# EAGLE design watch_game (EAGLE 8.5.0)
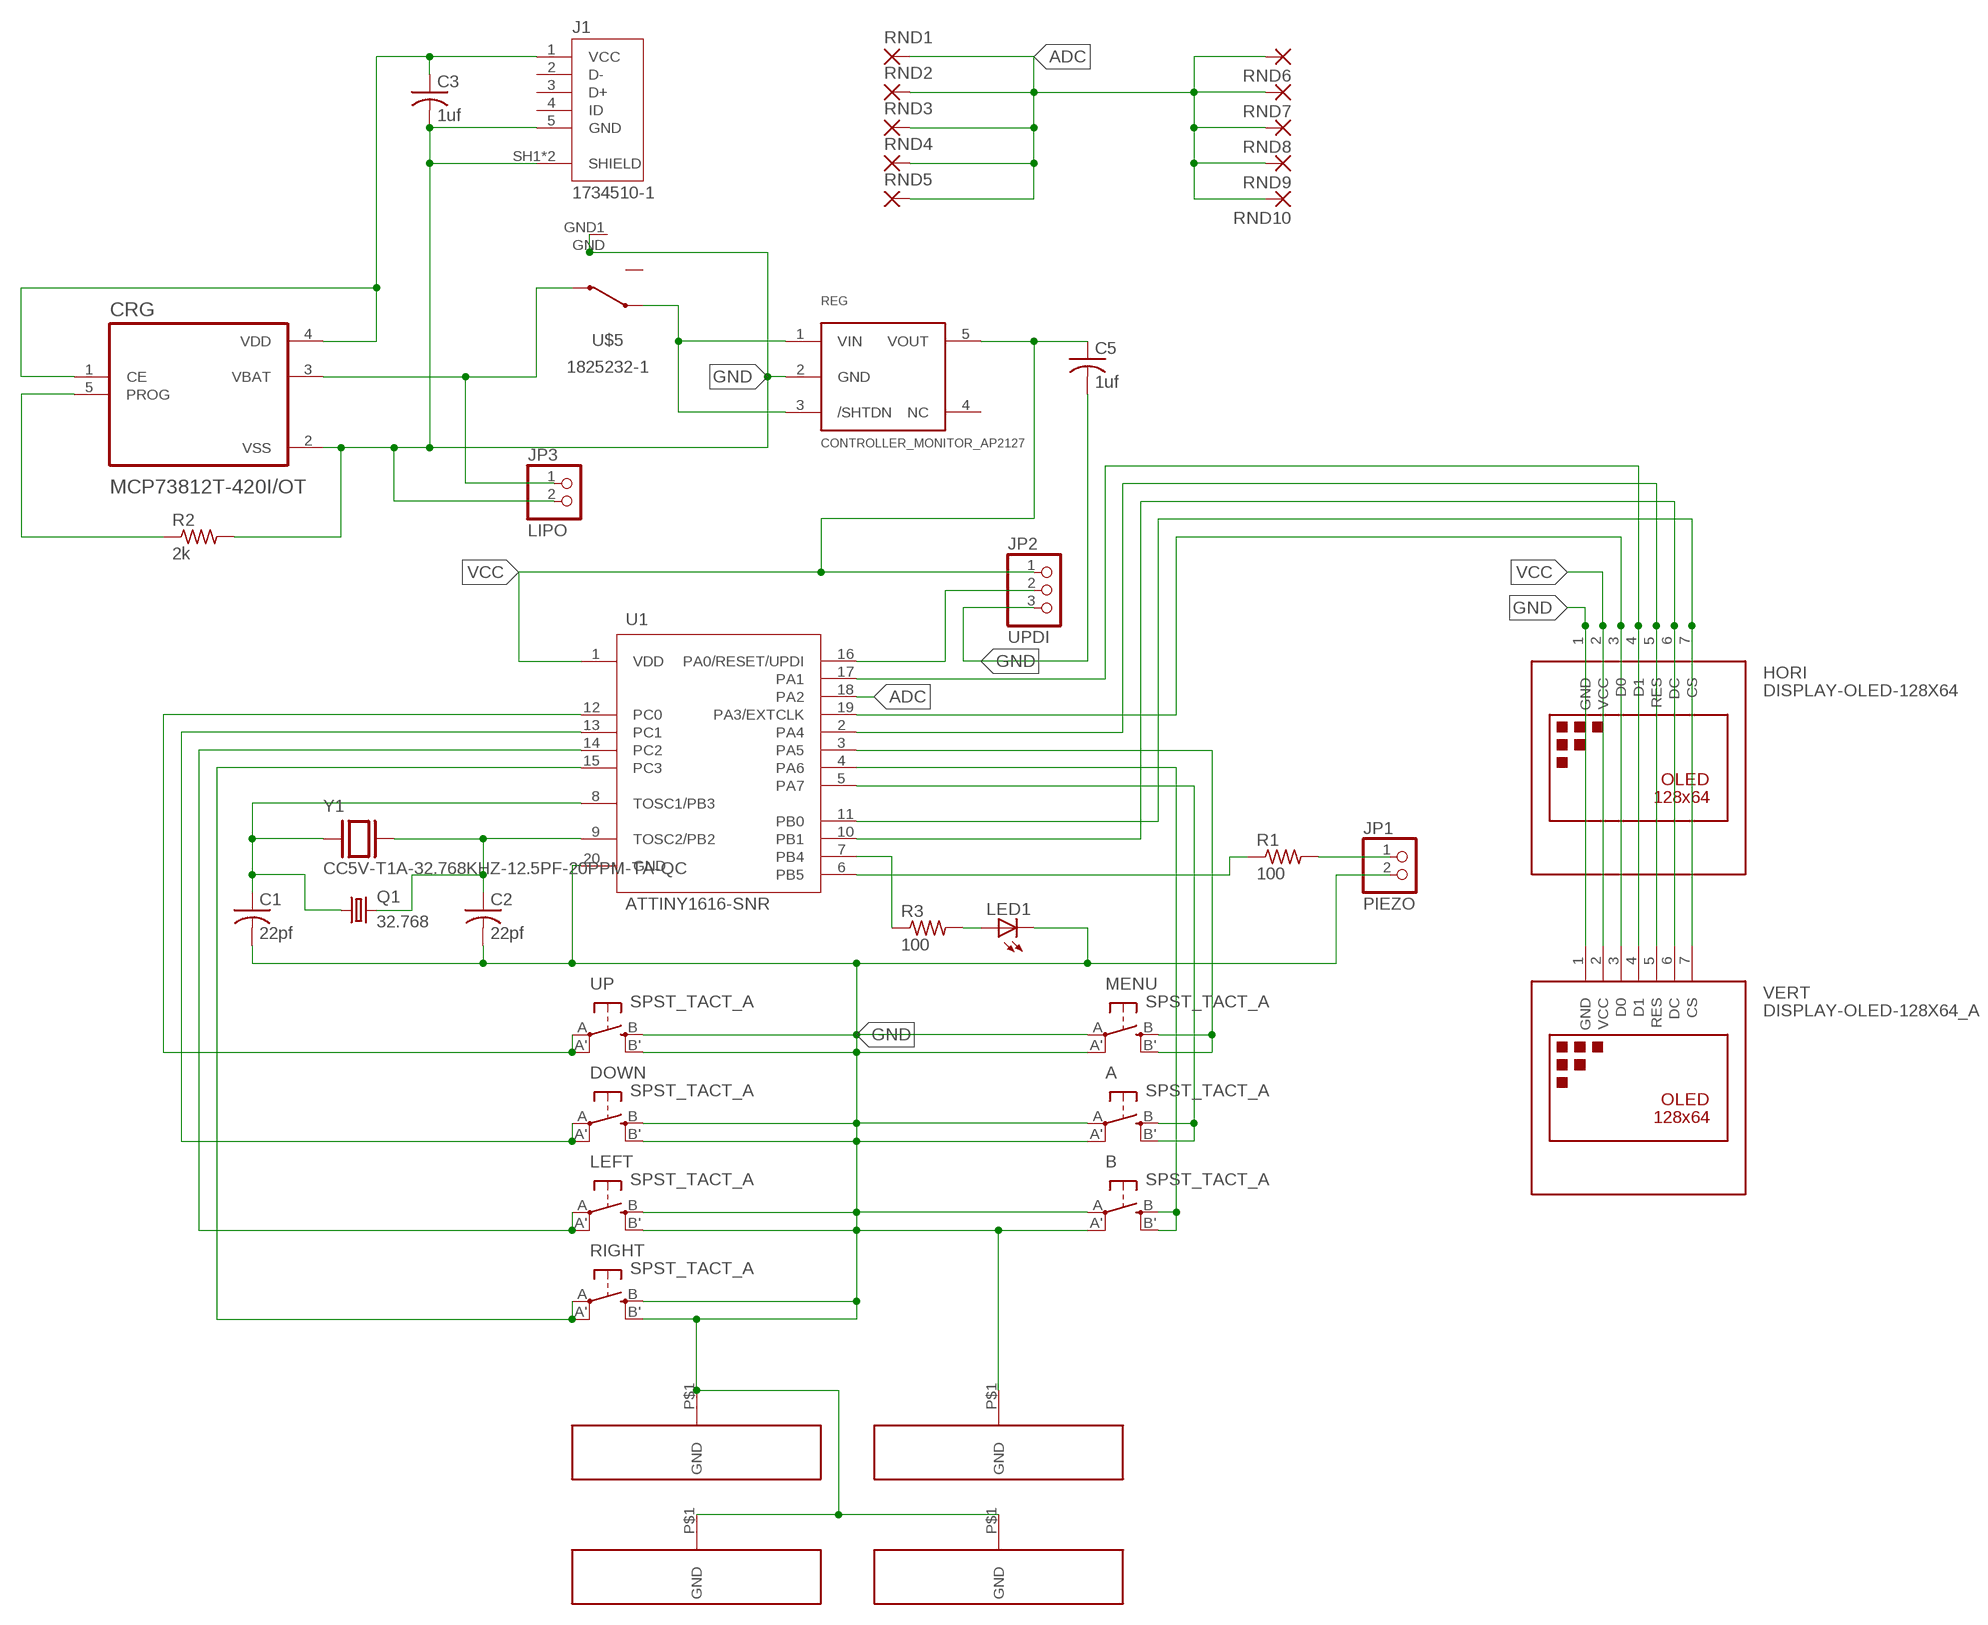
[diagram p0: schematic, sheet 1]

## Parts
A  SPST_TACT_A  [EVQ-Q2_A]
B  SPST_TACT_A  [EVQ-Q2_A]
C1  22pf  C-USC0805  [C0805]
C2  22pf  C-USC0805  [C0805]
C3  1uf  C-USC0805  [C0805]
C5  1uf  C-USC0805  [C0805]
CRG  MCP73812T-420I/OT  [SOT95P280X145-5N]
DOWN  SPST_TACT_A  [EVQ-Q2_A]
HORI  DISPLAY-OLED-128X64  [DISPLAY-OLED-128X64]
J1  1734510-1  [TE_1734510-1]
JP1  PIEZO  PINHD-1X2  [1X02]
JP2  UPDI  PINHD-1X3  [1X03]
JP3  LIPO  PINHD-1X2  [1X02]
LED1  LED5MM  [LED5MM]
LEFT  SPST_TACT_A  [EVQ-Q2_A]
MENU  SPST_TACT_A  [EVQ-Q2_A]
Q1  32.768  CRYSTALTC26H  [TC26H]
R1  100  R-US_M0805  [M0805]
R2  2k  R-US_M0805  [M0805]
R3  100  R-US_M0805  [M0805]
REG  CONTROLLER_MONITOR_AP2127  [CONTROLLER_MONITOR_SOT23-5]
RIGHT  SPST_TACT_A  [EVQ-Q2_A]
RND1  SMD5  [SMD2,54-5,08]
RND2  SMD5  [SMD2,54-5,08]
RND3  SMD5  [SMD2,54-5,08]
RND4  SMD5  [SMD2,54-5,08]
RND5  SMD5  [SMD2,54-5,08]
RND6  SMD5  [SMD2,54-5,08]
RND7  SMD5  [SMD2,54-5,08]
RND8  SMD5  [SMD2,54-5,08]
RND9  SMD5  [SMD2,54-5,08]
RND10  SMD5  [SMD2,54-5,08]
U1  ATTINY1616-SNR  [SOIC127P1032X265-20N]
U$5  1825232-1  [1825232-1]
U$6  GND_STRIP_600MIL  [GND_PADS_2]
U$7  GND_STRIP_600MIL  [GND_PADS_2]
U$8  GND_STRIP_600MIL  [GND_PADS_2]
U$9  GND_STRIP_600MIL  [GND_PADS_2]
UP  SPST_TACT_A  [EVQ-Q2_A]
VERT  DISPLAY-OLED-128X64_A  [DISPLAY-OLED-128X64_A]
Y1  CC5V-T1A-32.768KHZ-12.5PF-20PPM-TA-QC  [XTAL_CC5V-T1A-32.768KHZ-12.5PF-20PPM-TA-QC]

## Nets
ADC: RND1.1(P) RND2.1(P) RND3.1(P) RND4.1(P) RND5.1(P) RND6.1(P) RND7.1(P) RND8.1(P) RND9.1(P) RND10.1(P) U1.18(PA2)
GND: A.A'(P1) A.A(P) B.A'(P1) B.A(P) C1.2 C2.2 C3.2 C5.2 CRG.2(VSS) DOWN.B'(S1) DOWN.B(S) HORI.1(GND) J1.5(GND) J1.SH1(SHIELD) J1.SH2(SHIELD) JP1.2 JP2.3 JP3.2 LED1.K(C) LEFT.B'(S1) LEFT.B(S) MENU.A'(P1) MENU.A(P) R2.2 REG.2(GND) RIGHT.B'(S1) RIGHT.B(S) U1.20(GND) U$5.GND U$5.GND1 U$6.P$1(GND) U$7.P$1(GND) U$8.P$1(GND) U$9.P$1(GND) UP.B'(S1) UP.B(S) VERT.1(GND)
N$1: U1.12(PC0) UP.A'(P1) UP.A(P)
N$2: DOWN.A'(P1) DOWN.A(P) U1.13(PC1)
N$3: LEFT.A'(P1) LEFT.A(P) U1.14(PC2)
N$4: RIGHT.A'(P1) RIGHT.A(P) U1.15(PC3)
N$5: B.B'(S1) B.B(S) U1.4(PA6)
N$6: HORI.3(D0) U1.19(PA3/EXTCLK) VERT.3(D0)
N$7: R3.1 U1.7(PB4)
N$8: JP1.1 R1.2
N$9: C3.1 CRG.1(CE) CRG.4(VDD) J1.1(VCC)
N$10: REG.1(VIN) REG.3(/SHTDN) U$5.3
N$11: CRG.5(PROG) R2.1
N$12: CRG.3(VBAT) JP3.1 U$5.2
N$13: JP2.2 U1.16(PA0/RESET/UPDI)
N$14: HORI.4(D1) U1.17(PA1) VERT.4(D1)
N$16: HORI.5(RES) U1.2(PA4) VERT.5(RES)
N$17: MENU.B'(S1) MENU.B(S) U1.3(PA5)
N$18: LED1.A R3.2
N$19: A.B'(S1) A.B(S) U1.5(PA7)
N$20: HORI.7(CS) U1.11(PB0) VERT.7(CS)
N$21: HORI.6(DC) U1.10(PB1) VERT.6(DC)
N$23: R1.1 U1.6(PB5)
N$24: C1.1 Q1.1 U1.8(TOSC1/PB3) Y1.1
N$25: C2.1 Q1.2 U1.9(TOSC2/PB2) Y1.2
VCC: C5.1 HORI.2(VCC) JP2.1 REG.5(VOUT) U1.1(VDD) VERT.2(VCC)
Unconnected: J1.2(D-) J1.3(D+) J1.4(ID) REG.4(NC) U$5.1

## Library data of the parts
A B DOWN LEFT MENU RIGHT UP = adafruit:SPST_TACT_A: SMT 6mm switch, EVQQ2 series http://www.ladyada.net/library/eagle
C1 C2 = adafruit:C-US: CAPACITOR, American symbol
C3 C5 = rcl:C-US: CAPACITOR, American symbol; SPICEPREFIX: C
CRG = MCP73812T-420I_OT:MCP73812T-420I/OT: Check prices <https://pricing.snapeda.com/parts/MCP73812T-420I/OT/Microchip/view-part?ref=eda>; AVAILABILITY: In Stock; DESCRIPTION: Charger IC Lithium Ion/Polymer SOT-23-5; MF: Microchip; MP: MCP73812T-420I/OT; PACKAGE: SOT-23 Microchip; PRICE: None; PURCHASE-URL: https://pricing.snapeda.com/search/part/MCP73812T-420I/OT/?ref=eda
HORI = diy-modules:DISPLAY-OLED-128X64: 128x64 Dot Matrix OLED Module based on SSD1306 chip Variant with SPI interface More details available here: http://www.instructables.com/id/How-to-use-OLED-display-arduino-module/ SSD1306 datasheet: https://cdn-shop.adafruit.com/datasheets/SSD1306.pdf Click here to find device on ebay.com <http://www.ebay.com/sch/oled+display+128x64> Note: There are two variants: I2C and SPI. Search for the proper version.
J1 = USB 1734510-1:1734510-1: Conn Mini USB Type B RCP 5 POS 1.6mm Solder RA Thru-Hole 5 Terminal 1 Port Tray Check prices <https://pricing.snapeda.com/parts/1734510-1/TE%20Connectivity/view-part?ref=eda>; AVAILABILITY: In Stock; COMMENT: 1734510-1; DESCRIPTION: Conn Mini USB Type B RCP 5 POS 1.6mm Solder RA Thru-Hole 5 Terminal 1 Port Tray; MF: TE Connectivity; MP: 1734510-1; PACKAGE: None; PRICE: None; PURCHASE-URL: https://pricing.snapeda.com/search/part/1734510-1/?ref=eda
JP1 JP3 = pinhead:PINHD-1X2: PIN HEADER
JP2 = pinhead:PINHD-1X3: PIN HEADER
LED1 = led:LED: LED OSRAM: - CHIPLED LG R971, LG N971, LY N971, LG Q971, LY Q971, LO R971, LY R971 LH N974, LH R974 LS Q976, LO Q976, LY Q976 LO Q996 - Hyper CHIPLED LW Q18S LB Q993, LB Q99A, LB R99A - SideLED LS A670, LO A670, LY A670, LG A670, LP A670 LB A673, LV A673, LT A673, LW A673 LH A674 LY A675 LS A676, LA A676, LO A676, LY A676, LW A676 LS A679, LY A679, LG A679 - Hyper Micro SIDELED® LS Y876, LA Y876, LO Y876, LY Y876 LT Y87S - SmartLED LW L88C, LW L88S LB L89C, LB L89S, LG L890 LS L89K, LO L89K, LY L89K LS L896, LA L896, LO L896, LY L896 - TOPLED LS T670, LO T670, LY T670, LG T670, LP T670 LSG T670, LSP T670, LSY T670, LOP T670, LYG T670 LG T671, LOG T671, LSG T671 LB T673, LV T673, LT T673, LW T673 LH T674 LS T676, LA T676, LO T676, LY T676, LB T676, LH T676, LSB T676, LW T676 LB T67C, LV T67C, LT T67C, LS T67K, LO T67K, LY T67K, LW E67C LS E67B, LA E67B, LO E67B, LY E67B, LB E67C, LV E67C, LT E67C LW T67C LS T679, LY T679, LG T679 LS T770, LO T770, LY T770, LG T770, LP T770 LB T773, LV T773, LT T773, LW T773 LH T774 LS E675, LA E675, LY E675, LS T675 LS T776, LA T776, LO T776, LY T776, LB T776 LHGB T686 LT T68C, LB T68C - Hyper Mini TOPLED® LB M676 - Mini TOPLED Santana® LG M470 LS M47K, LO M47K, LY M47K Source: http://www.osram.convergy.de LUXEON: - LUMILED® LXK2-PW12-R00, LXK2-PW12-S00, LXK2-PW14-U00, LXK2-PW14-V00 LXK2-PM12-R00, LXK2-PM12-S00, LXK2-PM14-U00 LXK2-PE12-Q00, LXK2-PE12-R00, LXK2-PE12-S00, LXK2-PE14-T00, LXK2-PE14-U00 LXK2-PB12-K00, LXK2-PB12-L00, LXK2-PB12-M00, LXK2-PB14-N00, LXK2-PB14-P00, LXK2-PB14-Q00 LXK2-PR12-L00, LXK2-PR12-M00, LXK2-PR14-Q00, LXK2-PR14-R00 LXK2-PD12-Q00, LXK2-PD12-R00, LXK2-PD12-S00 LXK2-PH12-R00, LXK2-PH12-S00 LXK2-PL12-P00, LXK2-PL12-Q00, LXK2-PL12-R00 Source: www.luxeon.com KINGBRIGHT: KA-3528ASYC Source: www.kingbright.com
Q1 = adafruit:CRYSTAL: CRYSTAL; OC_FARNELL: unknown; OC_NEWARK: unknown
R1-R3 = resistor:R-US_: RESISTOR, American symbol
REG = Monitor_2018_j:CONTROLLER_MONITOR_AP2127
RND1-RND10 = wirepad:SMD5: SMD PAD
U1 = ATTINY1616-SNR:ATTINY1616-SNR: ATTiny1616 is a 20 pin Microcontroller with: - 5 selectable Voltage reference - 8 bit Dac - Multiplexable IOs(SPI, UART, I2C) And much more Datasheet <http://ww1.microchip.com/downloads/en/DeviceDoc/ATtiny1616-3216-DataSheet-DS40001997C.pdf> Check prices <https://pricing.snapeda.com/parts/ATTINY1616-SNR/Microchip/view-part?ref=eda>; AVAILABILITY: In Stock; DESCRIPTION: AVR tinyAVR™ 1, Functional Safety (FuSa) Microcontroller IC 8-Bit 20MHz 16KB (16K x 8) FLASH 20-SOIC; MF: Microchip; MP: ATTINY1616-SNR; PACKAGE: SOIC-20 Microchip; PRICE: None; PURCHASE-URL: https://pricing.snapeda.com/search/part/ATTINY1616-SNR/?ref=eda
U$5 = switch 1825232-1:1825232-1: Check prices <https://pricing.snapeda.com/parts/1825232-1/TE%20Connectivity/view-part?ref=eda>; AVAILABILITY: In Stock; COMMENT: 1825232-1; DESCRIPTION: Switch Slide ON None ON SPDT Side Slide 0.2A 30VDC 10000Cycle PC Pins Bracket Mount/Through Hole; EU_ROHS_COMPLIANCE: Compliant; MF: TE Connectivity; MP: 1825232-1; PACKAGE: None; PRICE: None; PURCHASE-URL: https://pricing.snapeda.com/search/part/1825232-1/?ref=eda
U$6-U$9 = Atari Vagabond:GND_STRIP_600MIL
VERT = diy-modules:DISPLAY-OLED-128X64_A: 128x64 Dot Matrix OLED Module based on SSD1306 chip Variant with SPI interface More details available here: http://www.instructables.com/id/How-to-use-OLED-display-arduino-module/ SSD1306 datasheet: https://cdn-shop.adafruit.com/datasheets/SSD1306.pdf Click here to find device on ebay.com <http://www.ebay.com/sch/oled+display+128x64> Note: There are two variants: I2C and SPI. Search for the proper version.
Y1 = CC5V-T1A-32.768KHZ-12.5PF-20PPM-TA-QC:CC5V-T1A-32.768KHZ-12.5PF-20PPM-TA-QC: Check prices <https://pricing.snapeda.com/parts/CC5V-T1A-32.768kHz-12.5pF-20PPM-TA-QC/Micro%20Crystal/view-part?ref=eda>; AVAILABILITY: In Stock; DESCRIPTION: LOW FREQUENCY CRYSTAL; MF: Micro Crystal; MP: CC5V-T1A-32.768kHz-12.5pF-20PPM-TA-QC; PACKAGE: SMT-2 Micro Crystal; PRICE: None; PURCHASE-URL: https://pricing.snapeda.com/search/part/CC5V-T1A-32.768kHz-12.5pF-20PPM-TA-QC/?ref=eda

## Board
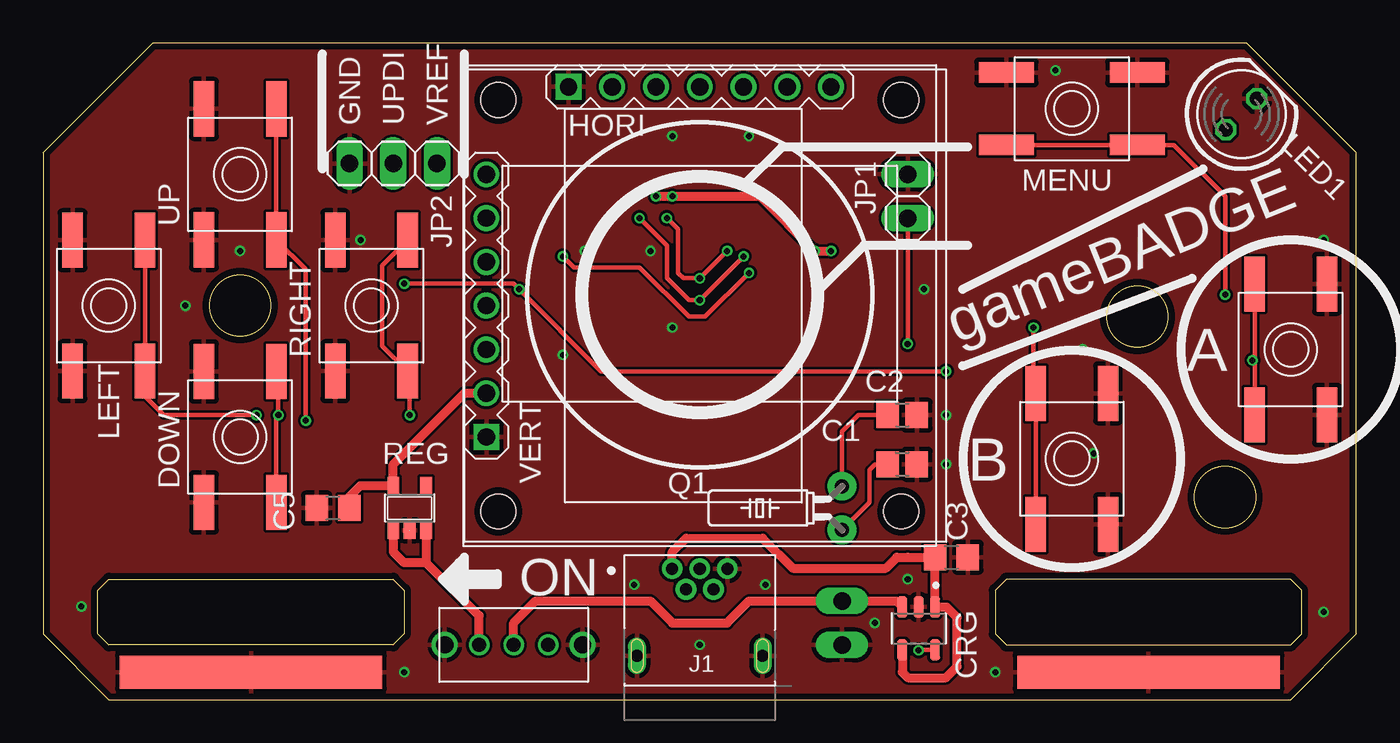
[diagram p1: board, top side]
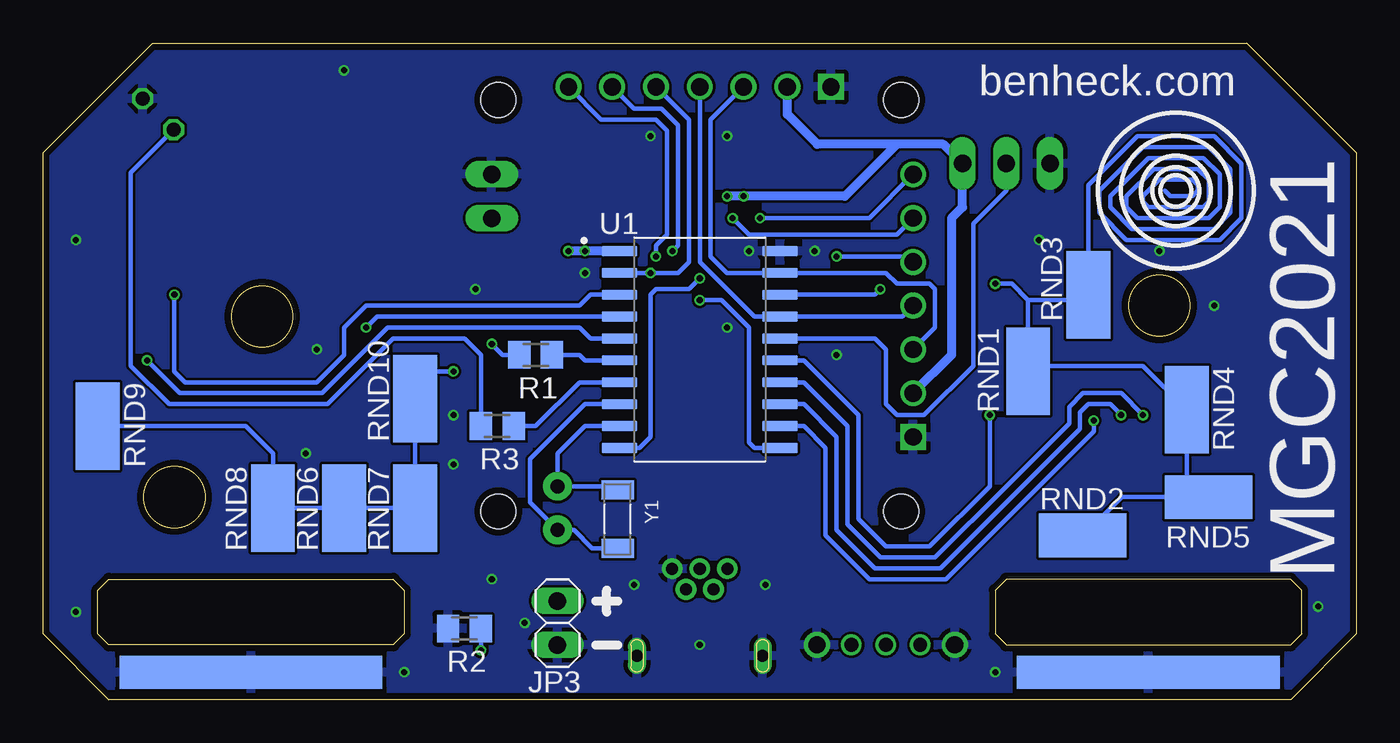
[diagram p2: board, bottom side, seen from below]

Size 76.2 x 38.1 mm. Coordinates in mm from the lower left corner, seen from the top.
Outline: 3.81,0 72.39,0 76.2,3.81 76.2,31.75 69.85,38.1 6.35,38.1 0,31.75 0,3.81 3.81,0
Outline: 3.17,3.81 3.17,6.35 3.81,6.99 20.32,6.99 20.95,6.35 20.95,3.81 20.32,3.17 3.81,3.17 3.17,3.81
Outline: 55.24,6.35 55.24,3.81 55.88,3.17 72.39,3.17 73.03,3.81 73.03,6.35 72.39,6.99 55.88,6.99 55.24,6.35
Outline: circle at 11.43,22.86 radius 1.78
Outline: circle at 68.58,11.75 radius 1.78
Outline: circle at 63.5,22.23 radius 1.78
Copper layers (1*16): Top 0.035559375mm / dielectric 1.6mm / Bottom 0.035559375mm
Design rules "oshpark-2layer": minimum track width 6mil, minimum drill 10mil, track to track 6mil, track to pad 6mil, pad to pad 6mil, via to via 6mil, smd to smd 6mil, copper to edge 15mil, drill to drill 6mil, minimum pad ring 5mil, minimum via ring 5mil, stop-mask expansion 2.5mil, vias tented up to drill 0mil, thermal gap 10mil

### Footprints (pad centres in the part's own frame; a part is rotated, then mirrored left to right if it is on the bottom)
EVQ-Q2_A = smd 3.2 x 1.2: A -3.8,-2.1; A' 3.8,-2.1; B -3.8,2.1; B' 3.8,2.1
C0805 = smd 1.3 x 1.5: 1 -0.85,0; 2 0.85,0
C0805' = smd 1.3 x 1.5: 1 -0.95,0; 2 0.95,0
SOT95P280X145-5N = smd 1.22 x 0.6: 1 -1.245,0.95; 2 -1.245,0; 3 -1.245,-0.95; 4 1.245,-0.95; 5 1.245,0.95
DISPLAY-OLED-128X64 = drill 1 square: 1 -7.62,12.7 | drill 1: 2 -5.08,12.7; 3 -2.54,12.7; 4 0,12.7; 5 2.54,12.7; 6 5.08,12.7; 7 7.62,12.7 | hole 2: -11.684,11.938; 11.684,11.938; 11.684,-11.938; -11.684,-11.938
TE_1734510-1 = drill 0.7 pad 1.2: 1 -1.6,5.05; 2 -0.8,3.85; 3 0,5.05; 4 0.8,3.85; 5 1.6,5.05 | drill 0.7 long: SH1 3.65,0; SH2 -3.65,0
1X02 = drill 1.016 long: 1 -1.27,0; 2 1.27,0
1X03 = drill 1.016 long: 1 -2.54,0; 2 0,0; 3 2.54,0
LED5MM = drill 0.813 octagon: A -1.27,0; K 1.27,0
TC26H = drill 0.813 pad 1.676: 1 -1.27,0; 2 1.27,0
M0805 = smd 1.3 x 1.6: 1 -0.95,0; 2 0.95,0
CONTROLLER_MONITOR_SOT23-5 = smd 0.69 x 0.99: 1 -0.95,-1.29; 2 0,-1.29; 3 0.95,-1.29; 4 0.95,1.3; 5 -0.95,1.3
SMD2,54-5,08 = smd 2.54 x 5.08: 1 0,0
SOIC127P1032X265-20N = smd 2.05 x 0.6: 1 -4.655,5.715; 2 -4.655,4.445; 3 -4.655,3.175; 4 -4.655,1.905; 5 -4.655,0.635; 6 -4.655,-0.635; 7 -4.655,-1.905; 8 -4.655,-3.175; 9 -4.655,-4.445; 10 -4.655,-5.715; 11 4.655,-5.715; 12 4.655,-4.445; 13 4.655,-3.175; 14 4.655,-1.905; 15 4.655,-0.635; 16 4.655,0.635; 17 4.655,1.905; 18 4.655,3.175; 19 4.655,4.445; 20 4.655,5.715
1825232-1 = drill 0.8: 1 -2,0; 2 0,0; 3 2,0 | drill 1: GND -4,0; GND1 4,0
GND_PADS_2 = smd 15.24 x 1.905: P$1 0,0
DISPLAY-OLED-128X64_A = drill 1 square: 1 -7.62,12.7 | drill 1: 2 -5.08,12.7; 3 -2.54,12.7; 4 0,12.7; 5 2.54,12.7; 6 5.08,12.7; 7 7.62,12.7
XTAL_CC5V-T1A-32.768KHZ-12.5PF-20PPM-TA-QC = smd 1.1 x 1.9: 1 -1.7,0; 2 1.7,0

### Placement (x,y rotation side)
A  72.39,20.32 90 top
B  59.69,13.97 90 top
C1  49.85,13.65 0 top
C2  49.85,16.51 0 top
C3  1uf  [C0805']  52.7,8.26 0 top
C5  1uf  [C0805']  16.83,11.11 180 top
CRG  50.8,4.13 270 top
DOWN  11.43,15.24 90 top
HORI  38.1,22.86 0 top
J1  38.1,2.54 0 top
JP1  50.16,29.21 90 top
JP2  20.32,31.11 180 top
JP3  46.35,4.45 270 bottom
LED1  69.53,33.97 45 top
LEFT  3.81,22.86 90 top
MENU  59.69,34.29 180 top
Q1  46.35,11.11 90 top
R1  47.62,20 180 bottom
R2  51.75,4.13 180 bottom
R3  49.85,15.88 180 bottom
REG  21.27,11.11 0 top
RIGHT  19.05,22.86 90 top
RND1  19.05,19.05 180 bottom
RND2  15.88,9.53 270 bottom
RND3  15.56,23.5 0 bottom
RND4  9.84,16.83 180 bottom
RND5  8.57,11.75 270 bottom
RND6  58.74,11.11 0 bottom
RND7  54.61,11.11 0 bottom
RND8  62.87,11.11 0 bottom
RND9  73.03,15.88 180 bottom
RND10  54.61,17.46 0 bottom
U1  38.1,20.32 0 bottom
U$5  27.3,3.17 180 top
U$6  12.06,1.59 0 top
U$7  64.14,1.59 0 top
U$8  12.06,1.59 180 bottom
U$9  64.14,1.59 0 bottom
UP  11.43,30.48 90 top
VERT  38.42,22.86 90 top
Y1  42.86,10.48 90 bottom

### Tracks (layer width: path | path; a pad name or v marks a point on that pad's centre or on a via)
ADC  (via drill 0.35)
  Top 0.254: v20.95,24.13 27.3,24.13 v27.62,23.81 32.38,19.05 v52.39,19.05
  Bottom 0.254: v27.62,23.81 27.94,23.5 U1.18 | v20.95,24.13 20,24.13 19.05,23.18 | RND1.1 19.05,19.37 | 19.05,19.37 19.05,23.18 | 19.05,23.18 15.88,23.18 RND3.1 15.56,29.84 12.7,32.7 8.26,32.7 6.67,31.11 6.67,27.94 7.94,26.67 13.34,26.67 14.92,28.26 14.92,29.53 12.38,32.07 8.57,32.07 7.3,30.8 7.3,28.26 8.26,27.3 13.02,27.3 14.29,28.57 14.29,29.21 12.06,31.43 8.89,31.43 7.94,30.48 7.94,28.57 8.57,27.94 12.7,27.94 13.34,28.57 13.34,29.21 11.75,30.8 9.21,30.8 8.57,30.16 8.57,28.89 8.89,28.57 12.06,28.57 12.38,28.89 12.38,29.21 11.43,30.16 9.53,30.16 9.21,29.84 9.21,29.53 9.53,29.21 10.79,29.21 11.11,29.53 | RND2.1 15.8,9.54 13.6,11.75 RND5.1 8.73,11.59 | 9.21,11.11 8.73,11.59 | 8.73,11.59 8.89,11.75 9.53,11.75 9.84,12.06 RND4.1 12.38,19.37 19.05,19.37 | RND9.1 64.45,15.88 62.87,14.29 RND8.1 RND6.1 RND7.1 RND10.1 54.61,19.05 v52.39,19.05
GND  (via drill 0.35)
  other vias: 11.43,26.04 35.24,26.04 31.43,26.04 36.51,21.59 48.26,4.45 50.16,6.99 38.1,3.17 34.29,6.67 41.91,6.67 40.96,32.7 36.51,32.7 55.24,1.59 52.39,13.65 52.39,16.51 8.26,22.86 18.41,26.67 60.96,14.29 30.16,20 44.77,24.77 51.12,23.81 58.74,36.51 74.3,5.08 2.22,5.4 20.95,1.59 60.33,20.32 74.3,26.67
  pour Top: -7.62,45.72 88.9,45.72 96.52,38.1 96.52,-12.7 -10.16,-12.7 -12.7,-10.16 -12.7,40.64
  pour Bottom: -7.62,-7.62 86.36,-7.62 91.44,-2.54 91.44,45.72 83.82,53.34 0,53.34 -7.62,45.72
N$1  (via drill 0.35)
  Top 0.254: UP.A' UP.A 15.24,24.97 v15.24,16.19
  Bottom 0.254: U1.12 32.07,15.88 30.8,14.61 30.8,9.53 28.26,6.99 23.81,6.99 15.24,15.56 v15.24,16.19
N$2  (via drill 0.35)
  Top 0.254: DOWN.A' 13.65,18.92 v13.65,16.51 13.53,16.39 DOWN.A
  Bottom 0.254: v13.65,16.51 14.29,17.14 15.56,17.14 16.03,16.67 16.03,15.72 24.13,7.62 27.94,7.62 30.16,9.84 30.16,15.24 32.07,17.14 U1.13
N$3  (via drill 0.35)
  Top 0.254: LEFT.A' LEFT.A 5.91,17.98 5.71,17.78 6.99,16.51 v12.38,16.51
  Bottom 0.254: U1.14 32.07,18.41 29.53,15.88 29.53,10.16 27.62,8.26 24.45,8.26 20.32,12.38 16.67,16.03 16.67,16.99 15.88,17.78 13.65,17.78 v12.38,16.51
N$4  (via drill 0.35)
  Top 0.254: RIGHT.A' 19.68,25.2 19.68,20.52 RIGHT.A 21.27,18.93 v21.27,16.51
  Bottom 0.254: U1.15 32.07,19.68 28.89,16.51 28.89,10.48 27.3,8.89 24.77,8.89 21.27,12.38 v21.27,16.51
N$5  (via drill 0.35)
  Top 0.254: v57.47,21.59 57.47,17.89 B.B' B.B
  Bottom 0.254: U1.4 56.83,22.23 v57.47,21.59
N$6
  Bottom 0.254: HORI.3 37.47,33.66 37.47,25.72 36.51,24.77 U1.19 27.3,24.77 26.67,24.13 24.77,24.13 24.45,23.81 24.45,21.59 VERT.3
N$7
  Bottom 0.254: U1.7 45.09,18.41 47.62,15.88 R3.1
N$8  (via drill 0.35)
  Top 0.254: v50.16,20.64 JP1.1
  Bottom 0.254: R1.2 49.53,20 v50.16,20.64
N$9
  Top 0.508: 36.48,7.59 J1.1 36.5,8.56 37.31,9.37 41.75,9.37 43.5,7.62 48.89,7.62 49.53,8.26 C3.1 | 50.16,8.25 C3.1 | C3.1 CRG.1 52.41,5.37 53.02,4.76 53.02,1.91 52.39,1.27 50.17,1.27 49.85,1.59 CRG.4
N$10
  Top 0.508: U$5.3 25.3,4.86 22.22,7.94 | REG.3 22.22,9.53 22.22,7.94 | 22.22,7.94 20.95,7.94 20.32,8.57 REG.1
N$11  (via drill 0.35)
  Top 0.254: CRG.5 50.83,2.88 v50.8,2.86
  Bottom 0.254: v50.8,2.86 R2.1
N$12
  Top 0.508: U$5.2 27.3,4.45 28.57,5.71 35.24,5.71 36.51,4.45 39.69,4.45 40.96,5.71 JP3.1 49.51,5.71 CRG.3
N$13
  Bottom 0.254: JP2.2 20.32,29.53 22.23,27.62 22.23,19.37 25.08,16.51 26.67,16.51 27.3,17.14 27.3,20.32 27.94,20.95 U1.16
N$14
  Bottom 0.254: HORI.4 38.1,25.4 34.92,22.23 U1.17 28.26,22.23 26.35,22.23 VERT.4
N$16  (via drill 0.35)
  Top 0.254: v40.96,24.77 38.42,22.23 37.47,22.23 34.61,25.08 30.8,25.08 v30.16,25.72
  Bottom 0.254: HORI.5 38.73,33.66 38.73,25.4 39.37,24.77 v40.96,24.77 U1.2 | VERT.5 26.04,25.72 v30.16,25.72
N$17  (via drill 0.35)
  Top 0.254: v68.58,23.5 68.58,29.21 65.6,32.19 MENU.B MENU.B'
  Bottom 0.254: U1.3 44.45,23.5 45.09,22.86 57.47,22.86 58.74,21.59 58.74,20 60.33,18.41 67.94,18.41 68.58,19.05 v68.58,23.5
N$18
  Bottom 0.254: LED1.A 71.12,30.59 71.12,19.37 68.9,17.14 59.69,17.14 55.88,20.95 51.75,20.95 50.8,20 R3.2
N$19  (via drill 0.35)
  Top 0.254: A.B 70.29,19.56 v70.17,19.68 70.29,19.81 A.B'
  Bottom 0.254: U1.5 44.45,20.95 45.09,21.59 56.2,21.59 60.01,17.78 68.26,17.78 v70.17,19.68
N$20  (via drill 0.35)
  Top 0.254: v40.64,25.72 v38.1,23.18 37.47,23.18 36.2,24.45 36.2,26.35 v34.61,27.94
  Bottom 0.254: U1.11 34.92,14.61 35.24,14.92 35.24,21.59 36.83,23.18 v38.1,23.18 | v40.64,25.72 40.64,26.35 40.01,26.99 40.01,30.48 39.99,31.11 39.99,33.01 40.64,33.66 43.81,33.66 HORI.7 | v34.61,27.94 28.26,27.94 VERT.7
N$21  (via drill 0.35)
  Top 0.254: v39.69,26.04 v38.1,24.45 37.15,24.45 36.83,24.77 36.83,27.3 v36.2,27.94
  Bottom 0.254: v39.69,26.04 39.37,26.35 39.37,33.34 40.32,34.29 41.91,34.29 HORI.6 | U1.10 41.59,14.61 40.96,15.24 | v36.2,27.94 35.24,26.99 26.67,26.99 VERT.6 | v38.1,24.45 38.73,23.81 40.64,23.81 40.96,23.5 40.96,15.24 | 40.96,15.24
N$23
  Bottom 0.254: U1.6 44.77,19.68 45.09,20 R1.1
N$24
  Top 0.254: Q1.1 47.94,11.43 47.94,13.34 48.26,13.65 C1.1
  Bottom 0.254: U1.8 44.77,17.14 47.94,13.97 47.94,11.43 Q1.1 45.4,9.84 44.34,8.78 Y1.1
N$25
  Top 0.254: Q1.2 46.35,15.56 47.31,16.51 C2.1
  Bottom 0.254: U1.9 44.77,15.88 46.35,14.29 Q1.2 43.07,12.38 Y1.2
VCC  (via drill 0.35)
  Top 0.508: v35.56,29.21 v36.51,29.21 41.59,29.21 v44.77,26.04 v45.72,26.04 | C5.1 17.78,11.78 18.41,12.41 REG.5 20.32,13.65 24.45,17.78 VERT.2
  Bottom 0.508: 26.67,32.23 23.97,32.23 JP2.1 22.86,28.57 23.5,27.94 23.5,20 VERT.2 | 26.67,32.23 29.69,29.21 v35.56,29.21 v36.51,29.21 | HORI.2 33.02,33.97 31.27,32.23 26.67,32.23 | U1.1 v44.77,26.04 v45.72,26.04

### Text on the board
tPlace: GND | UPDI | VREF | gameBADGE | ON
bPlace: benheck.com | MGC2021